# Altium schematic sheet Power_Conn.SchDoc
size A4; SheetNumber: 2; SheetTotal: 3
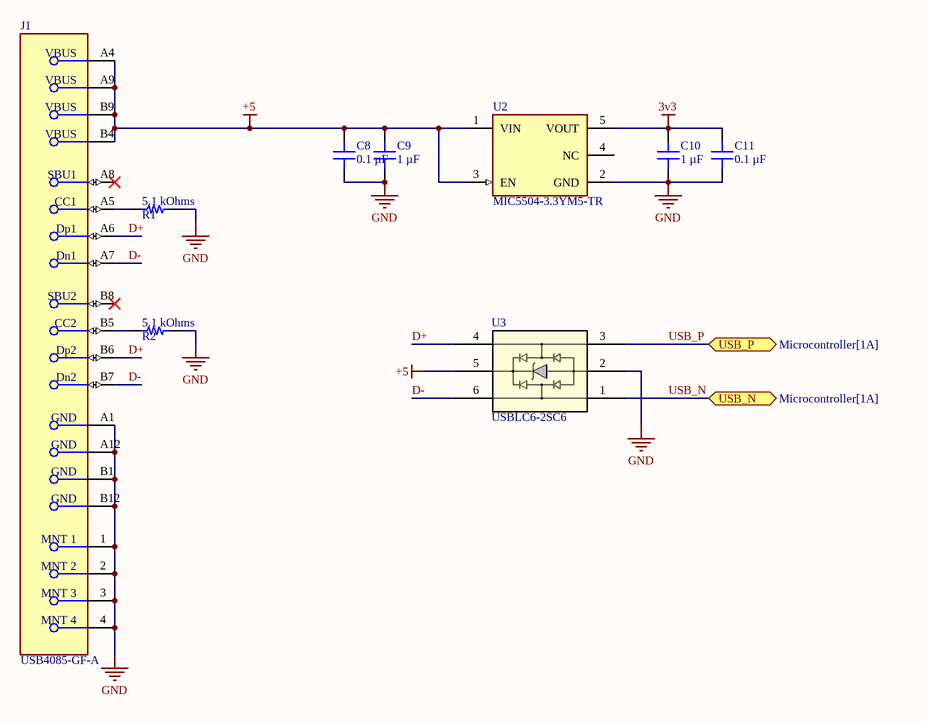
[diagram p0: Power_Conn.SchDoc]

## Parts
C8  0.1 µF  [CAP 0603_1608]
C9  1 µF  [CAP 0603_1608]
C10  1 µF  [CAP 0603_1608]
C11  0.1 µF  [CAP 0603_1608]
J1  USB4085-GF-A  [FP-USB4085-GF-A-MFG]
R1  5.1 kOhms  [RES 0805_2012]
R2  5.1 kOhms  [RES 0805_2012]
U2  MIC5504-3.3YM5-TR  [FP-SOT23-5LD-PL-1-MFG]
U3  USBLC6-2SC6  [SOT23-6L_STM]

## Ports
USB_N (bidir, see Microcontroller[1A]), USB_P (bidir, see Microcontroller[1A])

## Nets
3v3: C10.2 C11.2 U2.5(VOUT)
+5: C8.2 C9.2 J1.A4(VBUS) J1.A9(VBUS) J1.B4(VBUS) J1.B9(VBUS) U2.1(VIN) U2.3(EN) U3.5
GND: C8.1 C9.1 C10.1 C11.1 J1.1(MNT_1) J1.2(MNT_2) J1.3(MNT_3) J1.4(MNT_4) J1.A1(GND) J1.A12(GND) J1.B1(GND) J1.B12(GND) R1.2 R2.2 U2.2(GND) U3.2
D+: J1.A6(Dp1) J1.B6(Dp2) U3.4
D-: J1.A7(Dn1) J1.B7(Dn2) U3.6
USB_N: U3.1 ; port USB_N
USB_P: U3.3 ; port USB_P
NetJ1_A5: J1.A5(CC1) R1.1
NetJ1_B5: J1.B5(CC2) R2.1

Not connected (* = marked no-connect by the designer): J1 A8(SBU1)* B8(SBU2)*; U2 4(NC)

## Library data of the parts
C8 C11 = CL10B104KB8NNNC: CAP CER 0.1UF 50V X7R 0603; manufacturer: Samsung Electro-Mechanics; Tolerance: ±10%; Part Number: CL10B104KB8NNNC; Value: 0.1 µF; Applications: General Purpose; Capacitance: 0.1 µF; componentlink1description: Datasheet; componentlink1url: http://www.samsungsem.com/kr/support/product-search/mlcc/CL10B104KB8NNNC.jsp; componentlink2description: DigiKey Link; componentlink2url: https://www.digikey.com/en/products/detail/samsung-electro-mechanics/CL10B104KB8NNNC/3886658; Device Package: 0603 (1608 Metric); lastupdated: 2023-11-08 8:08:57 PM; Lifecycle Status: Active; Minimum Order: 1; Mounting Type: Surface Mount, MLCC; Operating Temperature: -55°C ~ 125°C; Package / Case: 0603 (1608 Metric); packaging: TapeAndReel; partid: 9788; Part Status: Active; price: 0.01; series: CL; Size / Dimension: 0.063" L x 0.031" W (1.60mm x 0.80mm); Supplier 1: DigiKey; Supplier Part Number 1: 1276-1000-1-ND; Temperature Coefficient: X7R; Thickness (Max): 0.035" (0.90mm); Voltage - Rated: 50V
C9 C10 = CL10B105KP8NFNC: CAP CER 1UF 10V X7R 0603; manufacturer: Samsung Electro-Mechanics; Tolerance: ±10%; Part Number: CL10B105KP8NFNC; Value: 1 µF; Applications: General Purpose; Capacitance: 1 µF; componentlink1description: Datasheet; componentlink1url: http://www.samsungsem.com/kr/support/product-search/mlcc/CL10B105KP8NFNC.jsp; componentlink2description: DigiKey Link; componentlink2url: https://www.digikey.com/en/products/detail/samsung-electro-mechanics/CL10B105KP8NFNC/3887603; Device Package: 0603 (1608 Metric); lastupdated: 2023-11-08 8:08:57 PM; Lifecycle Status: Active; Minimum Order: 1; Mounting Type: Surface Mount, MLCC; Operating Temperature: -55°C ~ 125°C; Package / Case: 0603 (1608 Metric); packaging: TapeAndReel; partid: 10019; Part Status: Active; price: 0.01; series: CL; Size / Dimension: 0.063" L x 0.031" W (1.60mm x 0.80mm); Supplier 1: DigiKey; Supplier Part Number 1: 1276-1945-1-ND; Temperature Coefficient: X7R; Thickness (Max): 0.035" (0.90mm); Voltage - Rated: 10V
J1 = CMP-196119-000001-2: CONN RCPT USB2.0 TYPE C 24POS RA; Gender: Receptacle; Number of Positions: 16; USB Standard: USB 2.0; Orientation: Right Angle; Contact Plating: Gold; Contact Material: Copper Alloy
R1 R2 = RC0805JR-075K1L: RES 5.1K OHM 5% 1/8W 0805; Manufacturer: Yageo; Power (Watts): 0.125W, 1/8W; Temperature Coefficient: ±100ppm/°C; Part Number: RC0805JR-075K1L; Value: 5.1 kOhms; ComponentLink1Description: Datasheet; ComponentLink1URL: https://www.yageo.com/upload/media/product/productsearch/datasheet/rchip/PYu-RC_Group_51_RoHS_L_10.pdf; ComponentLink2Description: DigiKey Link; ComponentLink2URL: https://www.digikey.com/en/products/detail/yageo/RC0805JR-075K1L/728338; Composition: Thick Film; Device Package: 0805 (2012 Metric); Features: Moisture Resistant; Height - Seated (Max): 0.024" (0.60mm); LastUpdated: 2023-01-02 8:43:52 PM; Lifecycle Status: Active; Minimum Order: 1; Number of Terminations: 2; Operating Temperature: -55°C ~ 155°C; Package / Case: 0805 (2012 Metric); Packaging: CutTape; PartId: 41971; Part Status: Active; Price: 0.01; Resistance: 5.1 kOhms; Series: RC_L; Size / Dimension: 0.079" L x 0.049" W (2.00mm x 1.25mm); Supplier 1: DigiKey; Supplier Part Number 1: 311-5.1KARCT-ND; Supplier Device Package: 0805; Tolerance: ±5%
U2 = CMP-2000-07604-2: IC REG LINEAR 3.3V 300MA SOT23-5; Quiescent Current: 38uA; Operating Supply Current: 42uA; Max Input Voltage: 5.5V; Min Input Voltage: 2.5V; Output Type: Fixed; Power Supply Rejection Ratio (PSRR): 60dB; Dropout Voltage: 380mV; Accuracy: 3%; Number of Outputs: 1; Nominal Output Voltage: 3.3V; Max Output Current: 300mA; Length: 2.9mm; Mount: Surface Mount; Width: 1.6mm; Packaging: Tape and Reel; Output Current: 300mA; Min Operating Temperature: -40°C; Max Operating Temperature: 125°C; Height: 1.1mm; Case/Package: SOT-23-5; REACH SVHC: No SVHC; Number of Pins: 5; Output Voltage: 3.3V
U3 = USBLC6-2SC6: No Description Available; Mfr_Name: STMicroelectronics; Copyright: Copyright (C) 2023 Ultra Librarian. All rights reserved.; Manufacturer_Part_Number: USBLC6-2SC6; RefDes: RefDes; Type: DEV